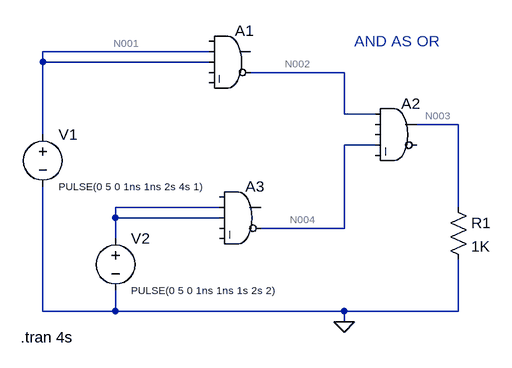
[diagram p0: schematic 203.asc]
203.asc, the LTspice schematic file:
Version 4
SHEET 1 880 680
WIRE 288 -16 32 -16
WIRE 32 0 32 -16
WIRE 288 0 32 0
WIRE 496 16 352 16
WIRE 496 80 496 16
WIRE 544 80 496 80
WIRE 672 96 608 96
WIRE 32 112 32 0
WIRE 544 128 496 128
WIRE 304 224 144 224
WIRE 672 224 672 96
WIRE 144 240 144 224
WIRE 304 240 144 240
WIRE 496 256 496 128
WIRE 496 256 368 256
WIRE 144 272 144 240
WIRE 32 384 32 192
WIRE 144 384 144 352
WIRE 144 384 32 384
WIRE 496 384 144 384
WIRE 672 384 672 304
WIRE 672 384 496 384
WIRE 496 400 496 384
FLAG 496 400 0
SYMBOL voltage 32 96 R0
WINDOW 3 24 96 Left 1
WINDOW 123 0 0 Left 0
WINDOW 39 0 0 Left 0
SYMATTR InstName V1
SYMATTR Value PULSE(0 5 0 1ns 1ns 2s 4s 1)
SYMBOL Digital\\and 320 -64 R0
SYMATTR InstName A1
SYMBOL Digital\\and 576 48 R0
SYMATTR InstName A2
SYMBOL Digital\\and 336 176 R0
SYMATTR InstName A3
SYMBOL res 656 208 R0
SYMATTR InstName R1
SYMATTR Value 1K
SYMBOL voltage 144 256 R0
WINDOW 3 24 96 Left 1
SYMATTR InstName V2
SYMATTR Value PULSE(0 5 0 1ns 1ns 1s 2s 2)
TEXT 512 -32 Left 2 ;AND AS OR
TEXT -2 424 Left 2 !.tran 4s

The netlist it stands for:
* 203.asc
V1 N001 0 PULSE(0 5 0 1ns 1ns 2s 4s 1)
A1 0 N001 N001 0 0 N002 0 0 AND
A2 N002 0 0 N004 0 0 N003 0 AND
A3 0 N005 N005 0 0 N004 0 0 AND
R1 N003 0 1K
V2 N005 0 PULSE(0 5 0 1ns 1ns 1s 2s 2)
* AND AS OR
.tran 4s
.backanno
.end

* Results of the author's LTspice run, read from the files saved beside the schematic
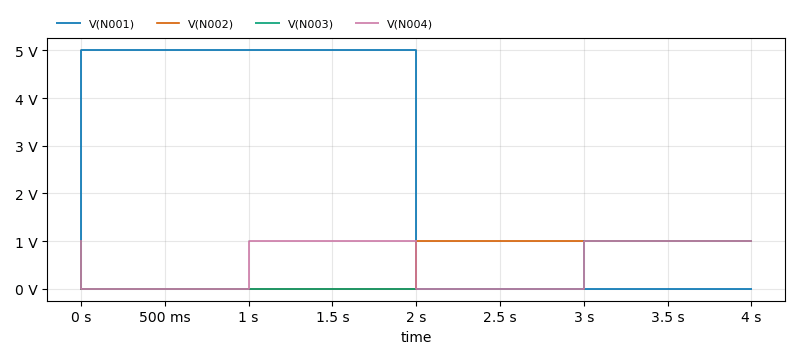
[diagram p1: Transient Analysis of 203.asc, plotted from the saved traces]
* Transient Analysis, 1 run:
*   V(N001): min 0 V, max 5 V, average 2.5 V, rms 3.536 V, last 0 V
*   V(N002): min 0 V, max 1 V, average 500 mV, rms 707.1 mV, last 1 V
*   V(N003): min 0 V, max 999 mV, average 249.8 mV, rms 499.5 mV, last 999 mV
*   V(N004): min 0 V, max 1 V, average 500 mV, rms 707.1 mV, last 1 V